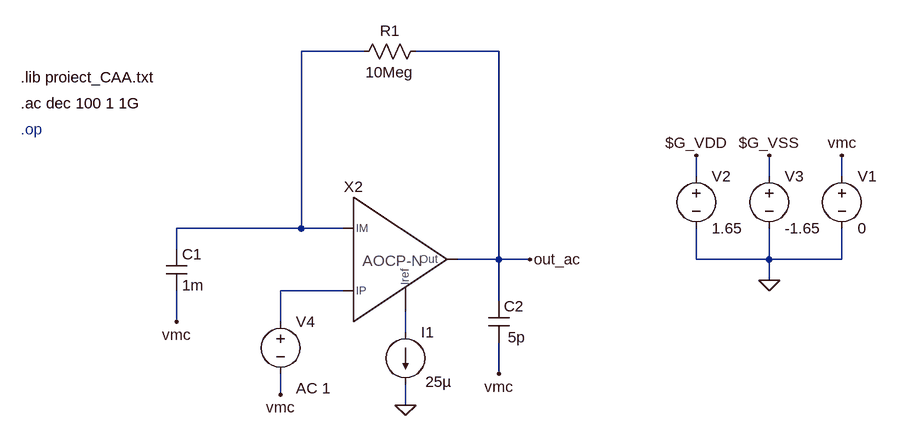
[diagram p0: schematic test_ao_cp_n_AC.asc]
test_ao_cp_n_AC.asc, the LTspice schematic file:
Version 4
SHEET 1 1600 1516
WIRE 592 112 496 112
WIRE 800 112 672 112
WIRE 1104 304 1104 272
WIRE 1216 304 1216 272
WIRE 1328 304 1328 272
WIRE 496 384 496 112
WIRE 496 384 304 384
WIRE 560 384 496 384
WIRE 304 416 304 384
WIRE 800 432 800 112
WIRE 800 432 736 432
WIRE 848 432 800 432
WIRE 1104 432 1104 384
WIRE 1216 432 1216 384
WIRE 1216 432 1104 432
WIRE 1328 432 1328 384
WIRE 1328 432 1216 432
WIRE 1216 464 1216 432
WIRE 560 480 464 480
WIRE 800 496 800 432
WIRE 304 528 304 480
WIRE 464 528 464 480
WIRE 656 544 656 512
WIRE 800 608 800 560
WIRE 464 640 464 608
WIRE 656 656 656 624
FLAG 1216 464 0
FLAG 1104 272 $G_VDD
FLAG 1216 272 $G_VSS
FLAG 1328 272 vmc
FLAG 304 528 vmc
FLAG 848 432 out_ac
FLAG 464 640 vmc
FLAG 800 608 vmc
FLAG 656 656 0
SYMBOL voltage 1104 288 R0
WINDOW 123 0 0 Left 2
WINDOW 39 0 0 Left 2
SYMATTR InstName V2
SYMATTR Value 1.65
SYMBOL voltage 1216 288 R0
WINDOW 123 0 0 Left 2
WINDOW 39 0 0 Left 2
SYMATTR InstName V3
SYMATTR Value -1.65
SYMBOL voltage 1328 288 R0
WINDOW 123 0 0 Left 2
WINDOW 39 0 0 Left 2
SYMATTR InstName V1
SYMATTR Value 0
SYMBOL res 688 96 R90
WINDOW 0 0 56 VBottom 2
WINDOW 3 32 56 VTop 2
SYMATTR InstName R1
SYMATTR Value 10Meg
SYMBOL cap 288 416 R0
SYMATTR InstName C1
SYMATTR Value 1m
SYMBOL current 656 544 R0
WINDOW 123 0 0 Left 2
WINDOW 39 0 0 Left 2
WINDOW 3 31 76 Left 2
SYMATTR Value 25µ
SYMATTR InstName I1
SYMBOL voltage 464 512 R0
WINDOW 123 24 118 Left 2
WINDOW 39 0 0 Left 2
SYMATTR Value2 AC 1
SYMATTR InstName V4
SYMATTR Value ""
SYMBOL cap 784 496 R0
WINDOW 3 30 56 Left 2
SYMATTR Value 5p
SYMATTR InstName C2
SYMBOL ao_cp_n 608 432 R0
SYMATTR InstName X2
TEXT 64 152 Left 2 !.lib proiect_CAA.txt
TEXT 64 192 Left 2 !.ac dec 100 1 1G
TEXT 64 232 Left 2 ;.op

The netlist it stands for:
* test_ao_cp_n_AC.asc
V2 $G_VDD 0 1.65
V3 $G_VSS 0 -1.65
V1 vmc 0 0
R1 out_ac N001 10Meg
C1 N001 vmc 1m
I1 N003 0 25µ
V4 N002 vmc AC 1
C2 out_ac vmc 5p
XX2 N001 N002 out_ac N003 ao_cp_n  ; pins IM IP Out Iref
.lib proiect_CAA.txt
.ac dec 100 1 1G
* .op
.backanno
.end